# EAGLE design Invictus R2 Bot (EAGLE 9.6.2)
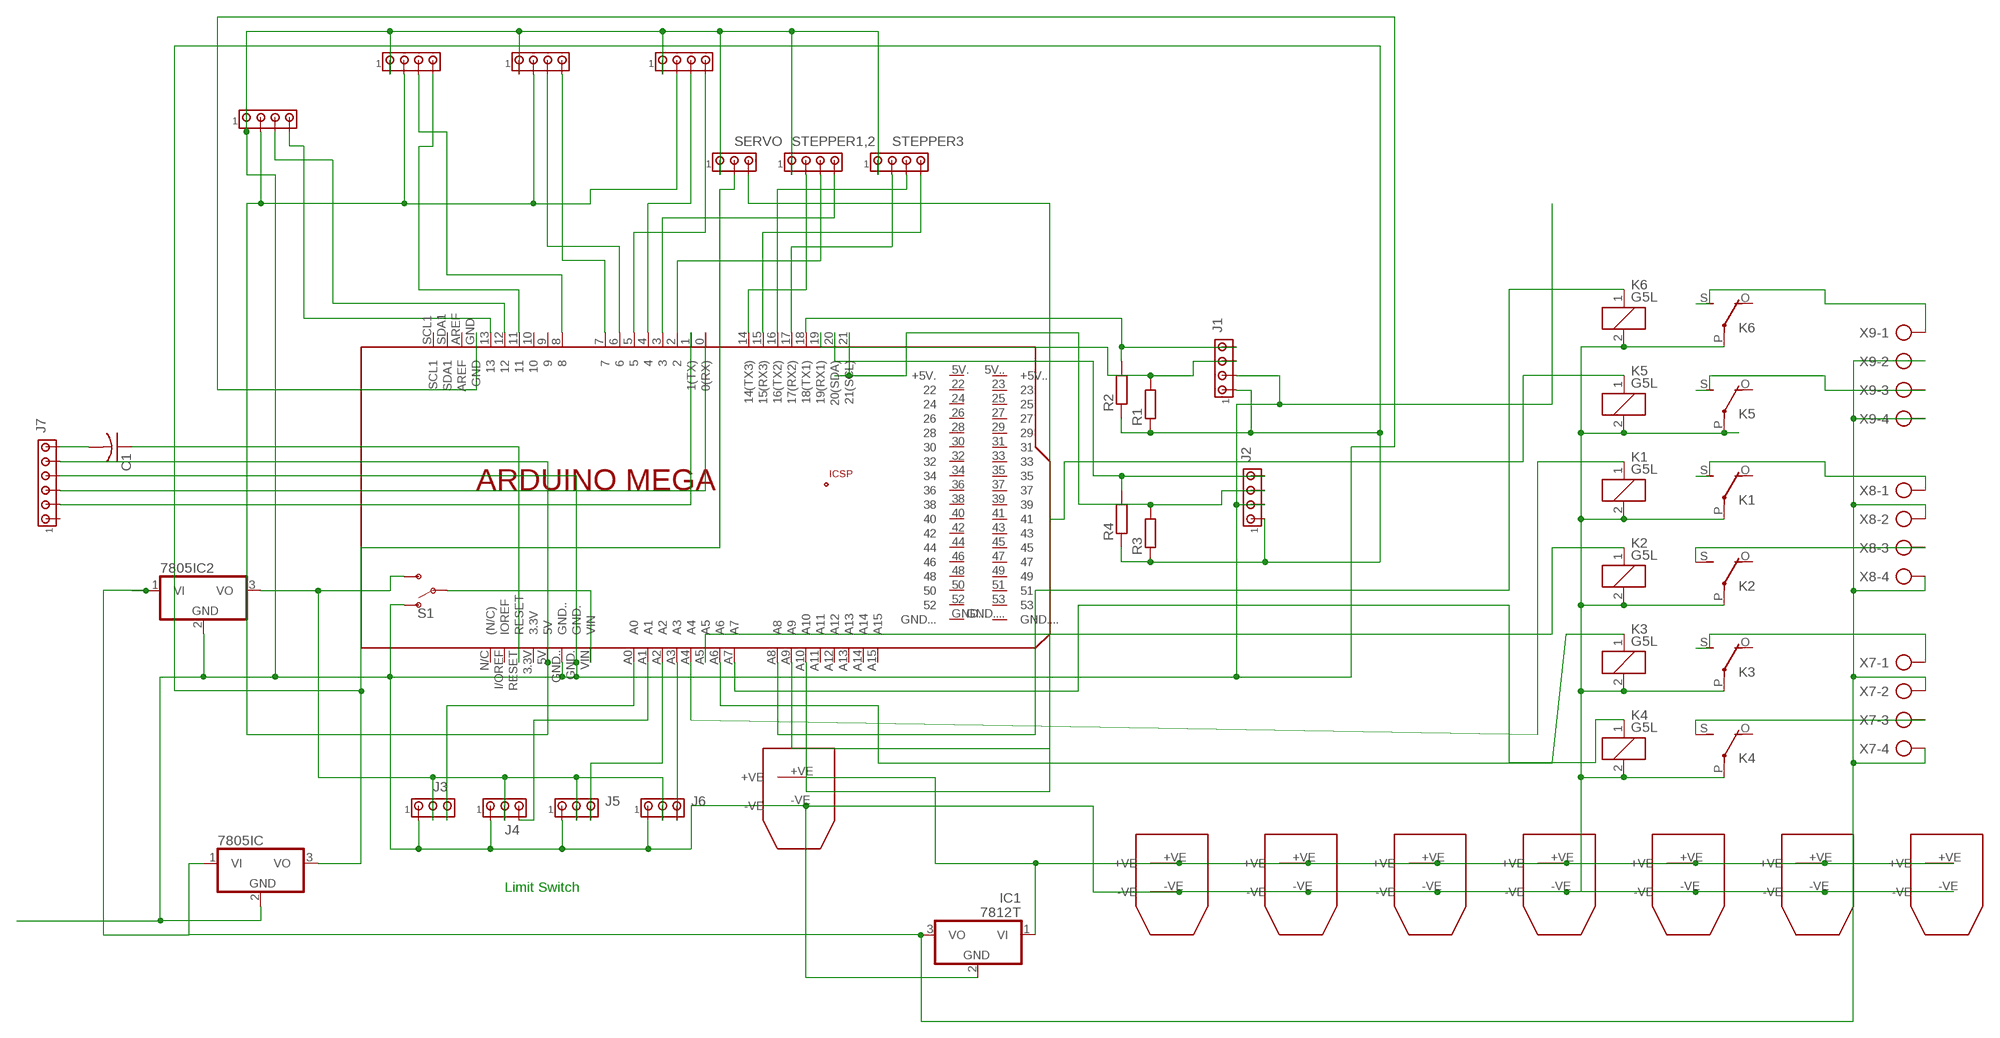
[diagram p0: schematic, sheet 1]

## Parts
7805IC  7812T  [TO220H]
7805IC2  7805T  [TO220H]
C1  C-US025-030X050  [C025-030X050]
IC1  7812T  [TO220H]
J1  MTA04-100  [10X04MTA]
J2  MTA04-100  [10X04MTA]
J3  MTA03-100  [10X03MTA]
J4  MTA03-100  [10X03MTA]
J5  MTA03-100  [10X03MTA]
J6  MTA03-100  [10X03MTA]
J7  MTA06-100  [10X06MTA]
K1  G5L  [G5LE]
K2  G5L  [G5LE]
K3  G5L  [G5LE]
K4  G5L  [G5LE]
K5  G5L  [G5LE]
K6  G5L  [G5LE]
PCB2  ARDUINO_MEGA2560  [ARDUINO_MEGA2560]
R1  R-EU_0207/7  [0207/7]
R2  R-EU_0207/7  [0207/7]
R3  R-EU_0207/7  [0207/7]
R4  R-EU_0207/7  [0207/7]
S1  SWITCH-SPDT-PTH-11.6X4.0MM  [SWITCH_SPDT_PTH_11.6X4.0MM]
SERVO  MTA03-100  [10X03MTA]
STEPPER1,1  MTA04-100  [10X04MTA]
STEPPER1,2  MTA04-100  [10X04MTA]
STEPPER1,3  MTA04-100  [10X04MTA]
STEPPER1,4  MTA04-100  [10X04MTA]
STEPPER1,5  MTA04-100  [10X04MTA]
STEPPER3  MTA04-100  [10X04MTA]
X7  AK500/4-H  [AK500/4-H]
X8  AK500/4-H  [AK500/4-H]
X9  AK500/4-H  [AK500/4-H]
XT1  XT60XT60  [XT60]
XT2  XT60XT60  [XT60]
XT3  XT60XT60  [XT60]
XT4  XT60XT60  [XT60]
XT5  XT60XT60  [XT60]
XT6  XT60XT60  [XT60]
XT7  XT60XT60  [XT60]
XT60  XT60XT60  [XT60]

## Nets
5V: 7805IC.3(VO) J1.1 J2.1 R1.1 R2.1 R3.1 R4.1 SERVO.2
12V: 7805IC2.1(VI) 7805IC.1(VI) IC1.3(VO) X7.2 X7.4 X8.2 X8.4 X9.2 X9.4
GND: 7805IC2.2(GND) 7805IC.2(GND) IC1.2(GND) J1.2 J2.2 J3.1 J4.1 J5.1 J6.1 J7.4 K1.2 K1.P(2:P) K2.2 K2.P(2:P) K3.2 K3.P(2:P) K4.2 K4.P(2:P) K5.2 K5.P(2:P) K6.2 K6.P(2:P) PCB2.GND PCB2.GND. PCB2.GND.. S1.1(O) SERVO.1 STEPPER1,1.1 STEPPER1,2.1 STEPPER1,3.1 STEPPER1,4.1 STEPPER1,5.1 STEPPER3.1 XT1.-VE XT2.-VE XT3.-VE XT4.-VE XT5.-VE XT6.-VE XT7.-VE XT60.-VE
N$1: PCB2.VIN S1.2(P)
N$2: K4.1 PCB2.A7
N$3: PCB2.5 STEPPER1,5.4
N$4: K3.1 PCB2.A6
N$5: PCB2.3 STEPPER1,2.4
N$6: J2.4 PCB2.20(20(SDA)) R4.2
N$7: J2.3 PCB2.21(21(SCL)) R3.2
N$8: J1.3 PCB2.19(19(RX1)) R1.2
N$9: PCB2.4 STEPPER1,5.3
N$10: PCB2.6 STEPPER1,4.3
N$11: PCB2.13 STEPPER1,1.4
N$12: PCB2.12 STEPPER1,1.3
N$13: PCB2.11 STEPPER1,3.4
N$14: PCB2.8 STEPPER1,3.3
N$15: PCB2.7 STEPPER1,4.4
N$16: PCB2.17(17(RX2)) STEPPER3.2
N$17: J1.4 PCB2.18(18(TX1)) R2.2
N$18: K2.1 PCB2.A5
N$19: PCB2.16(16(TX2)) STEPPER3.3
N$20: K1.1 PCB2.A4
N$21: J7.3 PCB2.0(0(RX))
N$22: K6.1 PCB2.A8
N$23: PCB2.A10 SERVO.3
N$24: J6.3 PCB2.A3
N$25: J7.2 PCB2.1(1(TX))
N$26: PCB2.2 STEPPER1,2.3
N$27: PCB2.14(14(TX3)) STEPPER1,2.2
N$28: PCB2.15(15(RX3)) STEPPER3.4
N$29: J3.3 PCB2.A0
N$30: J4.3 PCB2.A1
N$31: J5.3 PCB2.A2
N$32: K5.1 PCB2.A9
N$33: C1.1 PCB2.RESET
N$34: 7805IC2.3(VO) J3.2 J4.2 J5.2 J6.2 S1.3(S)
N$35: K6.S(2:S) X9.1
N$36: K5.S(2:S) X9.3
N$37: K1.S(2:S) X8.1
N$38: K2.S(2:S) X8.3
N$39: K3.S(2:S) X7.1
N$40: C1.2 J7.6
N$42: K4.S(2:S) X7.3
N$45: J7.5 PCB2.5V STEPPER1,1.2 STEPPER1,3.2 STEPPER1,4.2 STEPPER1,5.2
VCC: IC1.1(VI) XT1.+VE XT2.+VE XT3.+VE XT4.+VE XT5.+VE XT6.+VE XT7.+VE XT60.+VE
Unconnected: J7.1 K1.O(2:O) K2.O(2:O) K3.O(2:O) K4.O(2:O) K5.O(2:O) K6.O(2:O) PCB2.3.3V PCB2.5V.(+5V.) PCB2.5V..(+5V..) PCB2.9 PCB2.10 PCB2.22 PCB2.23 PCB2.24 PCB2.25 PCB2.26 PCB2.27 PCB2.28 PCB2.29 PCB2.30 PCB2.31 PCB2.32 PCB2.33 PCB2.34 PCB2.35 PCB2.36 PCB2.37 PCB2.38 PCB2.39 PCB2.40 PCB2.41 PCB2.42 PCB2.43 PCB2.44 PCB2.45 PCB2.46 PCB2.47 PCB2.48 PCB2.49 PCB2.50 PCB2.51 PCB2.52 PCB2.53 PCB2.+5V_ PCB2.A11 PCB2.A12 PCB2.A13 PCB2.A14 PCB2.A15 PCB2.AREF PCB2.GND... PCB2.GND.... PCB2.GND__ PCB2.I/OREF(IOREF) PCB2.MISO PCB2.MOSI PCB2.N/C((N/C)) PCB2.RESET. PCB2.SCK PCB2.SCL1 PCB2.SDA1

## Notes on the sheet
- Limit Switch

## Library data of the parts
7805IC 7805IC2 IC1 = linear:78*: Positive VOLTAGE REGULATOR Source: http://cache.national.com/ds/LM/LM78L05.pdf http://www.fairchildsemi.com/ds/LM/LM7805.pdf
C1 = resistor:C-US: CAPACITOR, American symbol
J1 J2 STEPPER1,1-STEPPER1,5 STEPPER3 = con-amp:MTA04-100: AMP connector
J3-J6 SERVO = con-amp:MTA03-100: AMP connector
J7 = con-amp:MTA06-100: AMP connector Connection corrected 2014-09-19
K1-K6 = relay:G5L: RELAY 1 x switch, 10 A/120 V AC, 8 A/30 V ADC, Omron; OC_FARNELL: unknown; OC_NEWARK: unknown
PCB2 = E14_Arduino_revC:ARDUINO_MEGA2560: Device for representing an Arduino Mega 2560 board with a footprint in an EAGLE design. Created by Dave Young for Element14. More EAGLE documentation at: http://www.element14.com/community/community/knode/cadsoft_eagle
R1-R4 = rcl:R-EU_: RESISTOR, European symbol; SPICEPREFIX: R
S1 = SparkFun-Switches:SWITCH-SPDT: Single Pole, Double Throw (SPDT) Switch Single-pole, double-throw (SPDT) switch. Variant Overview SMD-AYZ0202 Surface Mount DPDT Switch <https://www.sparkfun.com/products/597> (COM-00597) Used on e.g. LilyPad Arduino USB - ATmega32U4 Board <https://www.sparkfun.com/products/12049> PTH-11.6X4.0MM SPDT Mini Power Switch <https://www.sparkfun.com/products/102> (COM-00102) Used on e.g. SparkFun Simon Says - Through-Hole Soldering Kit <https://www.sparkfun.com/products/10547> (KIT-10547) PTH-11.6X4.0MM-KIT KIT version of SPDT Mini Power Switch - Simplifies soldering by removing tStop of switch pins - only one side can be soldered. PTH-11.6X4.0MM-LOCK LOCK version of SPDT Mini Power Switch - Offset pins hold switch in place for easier soldering. SMD-RIGHT-ANGLE Surface Mount Right Angle Switch <https://www.sparkfun.com/products/10860> (COM-10860) Used on e.g. SparkFun ESP8266 Thing <https://www.sparkfun.com/products/13231>; PROD_ID: SWCH-08261; SF_SKU: COM-00102
X7-X9 = con-ptr500:AK500/4-H: CONNECTOR Aug. 2004 / PTR Meßtechnik: Die Bezeichnung der Serie AK505 wurde geändert. Es handelt sich hierbei um AK500 in horizontaler Ausführung.; OC_FARNELL: unknown; OC_NEWARK: unknown
XT1-XT7 XT60 = xt60:XT60: XT60 connector

## Board
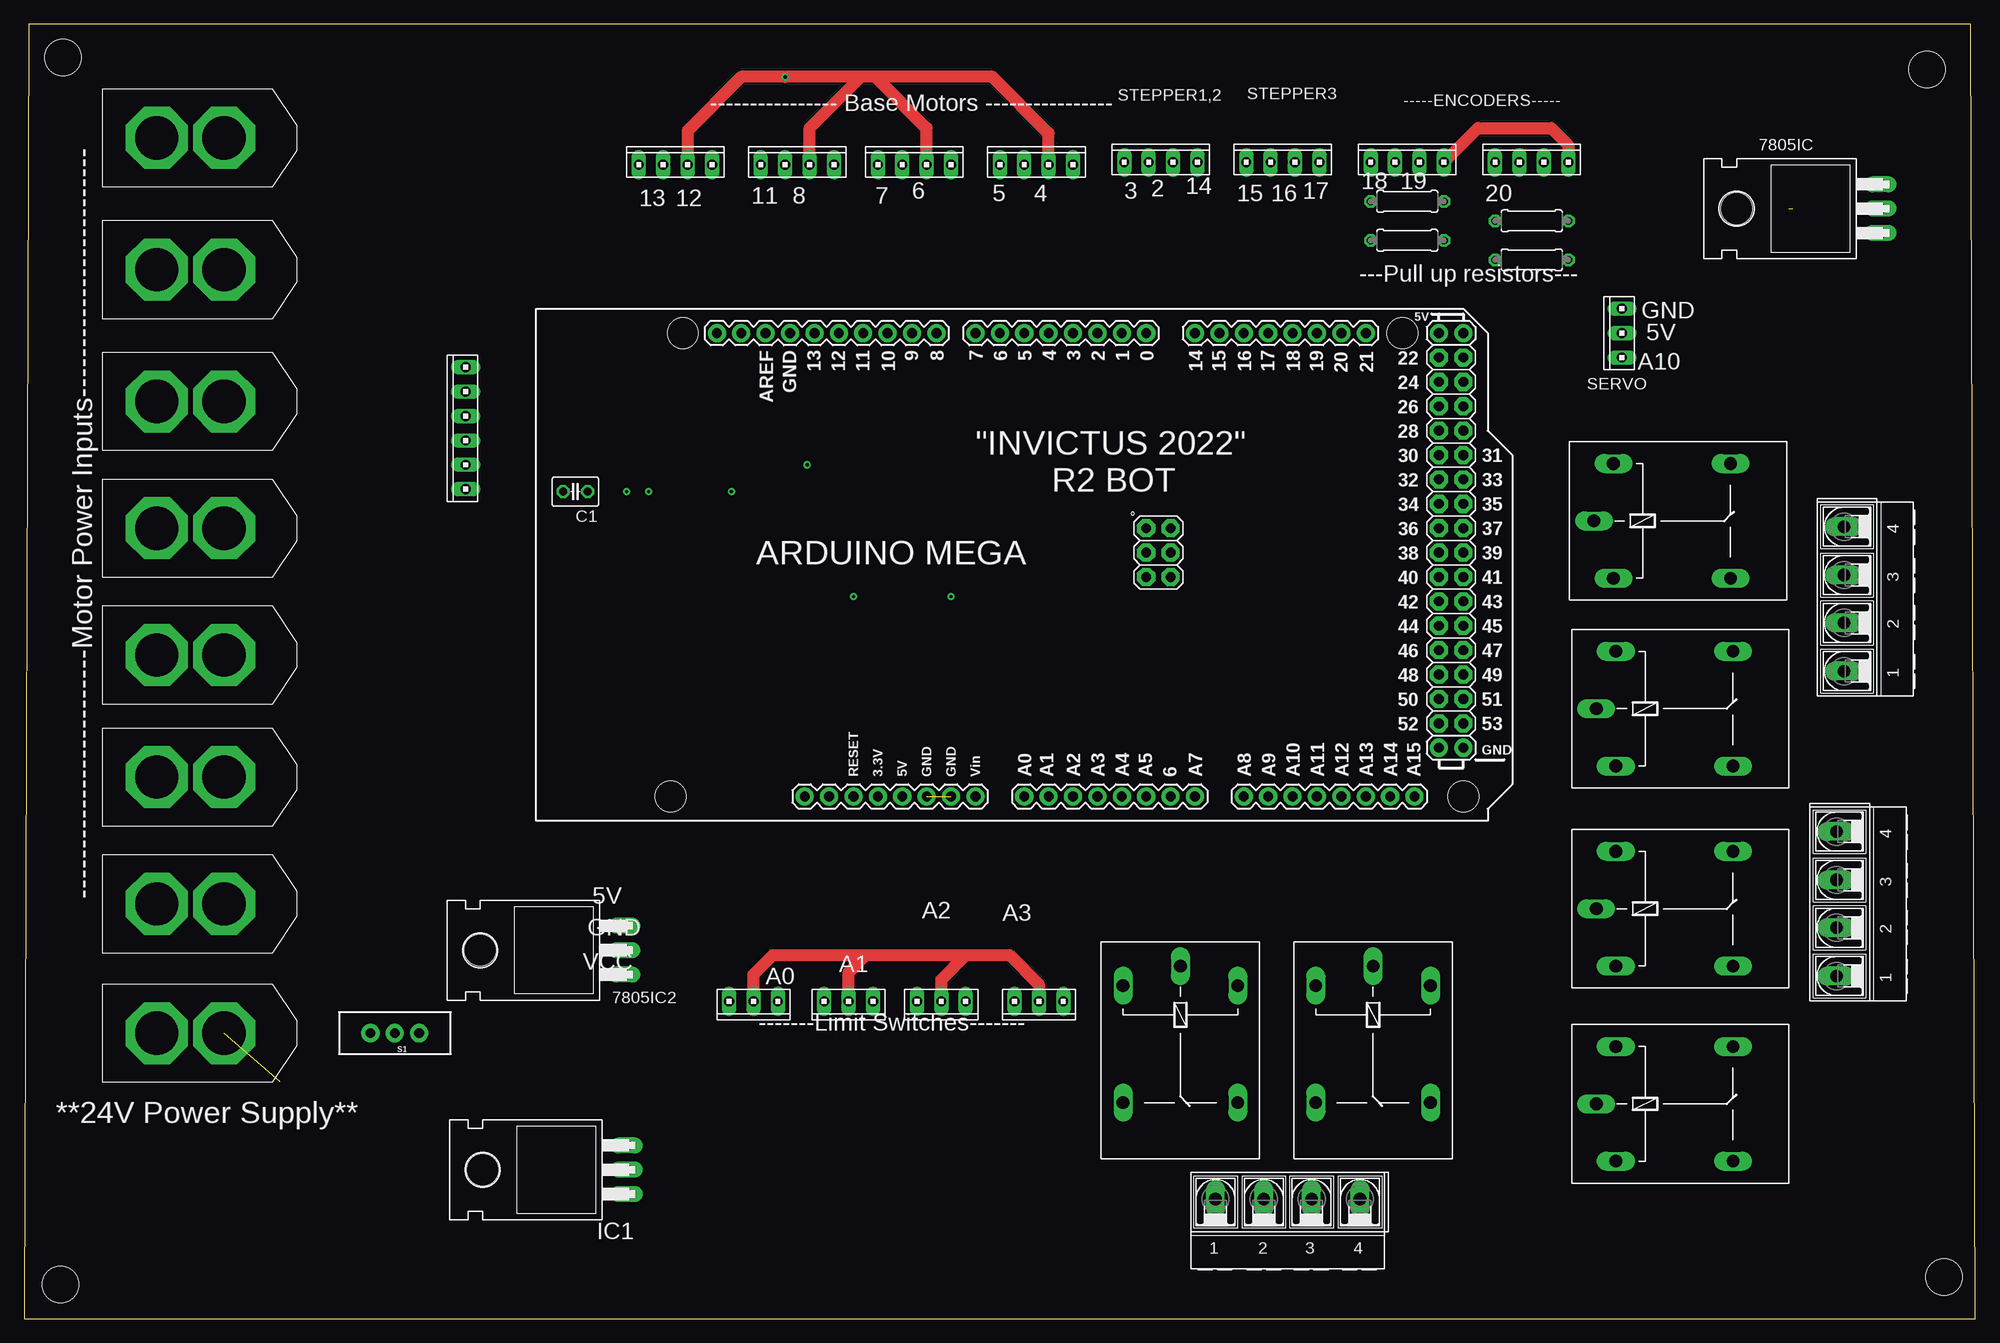
[diagram p1: board, top side]
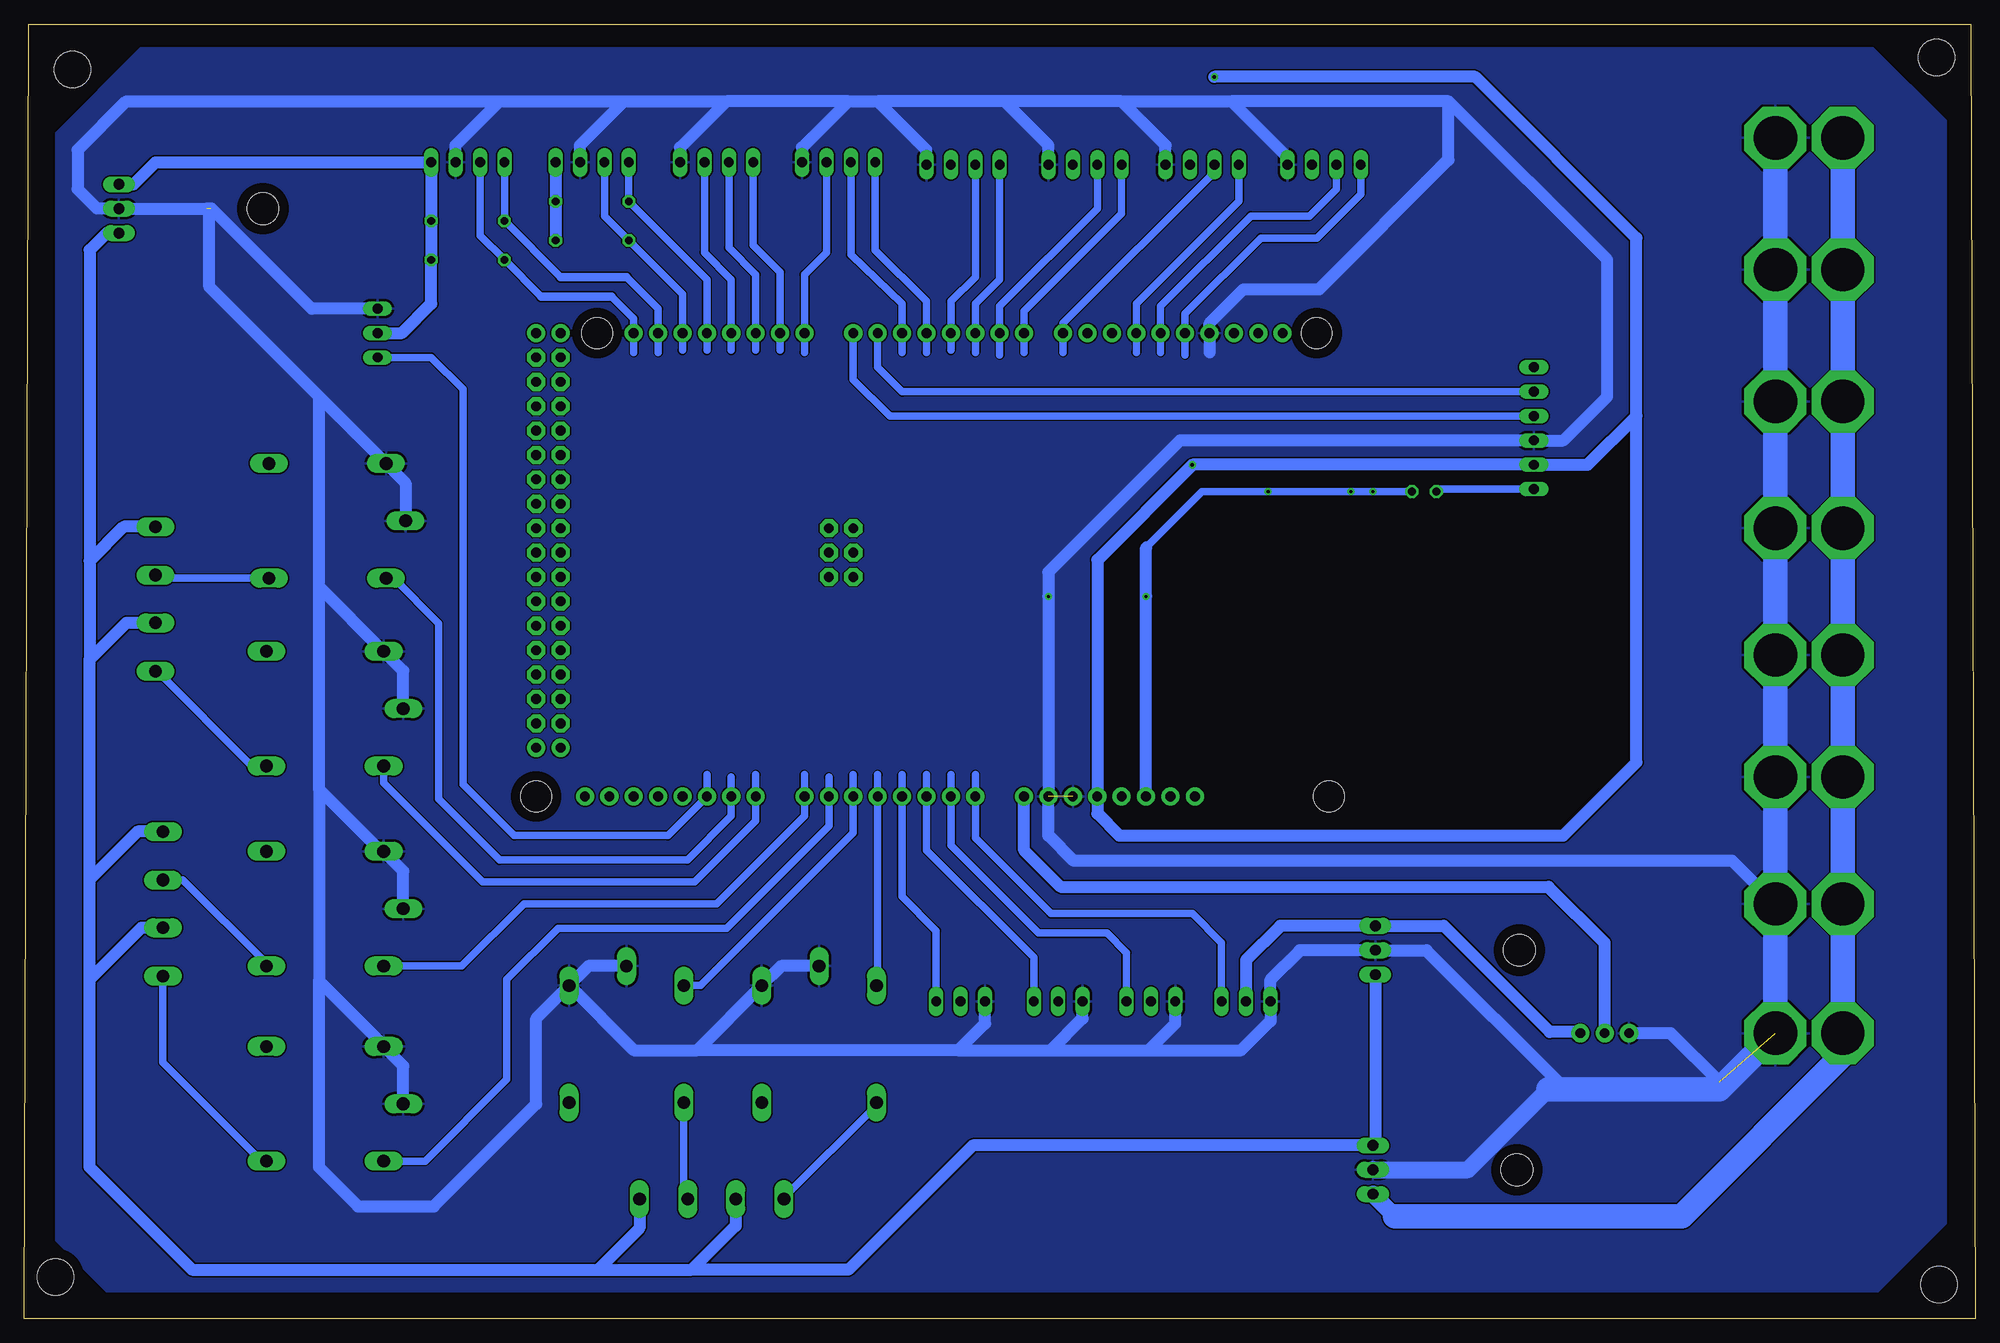
[diagram p2: board, bottom side, seen from below]

Size 203.18 x 134.8 mm. Coordinates in mm from the lower left corner, seen from the top.
Outline: 0,0 203.18,0 202.67,134.8 0.51,134.8 0,0
Copper layers (1*16): Top 0.035mm / dielectric 1.5mm / Bottom 0.035mm
Design rules "default": minimum track width 6mil, minimum drill 0.35mm, track to track 6mil, track to pad 6mil, pad to pad 6mil, via to via 6mil, smd to smd 6mil, copper to edge 40mil, drill to drill 6mil, minimum pad ring 10mil, minimum via ring 8mil, stop-mask expansion 4mil, vias tented up to drill 0mil, thermal gap 10mil
Holes 3.81 mm at 3.81,3.56 199.9,4.32 198.12,130.05 4.06,131.32

### Footprints (pad centres in the part's own frame; a part is rotated, then mirrored left to right if it is on the bottom)
TO220H = drill 1.118 long: 1 -2.54,-10.16; 2 0,-10.16; 3 2.54,-10.16 | hole 3.302: 0,4.826
C025-030X050 = drill 0.813 octagon: 1 -1.27,0; 2 1.27,0
10X04MTA = drill 1.016 long: 1 3.81,0; 2 1.27,0; 3 -1.27,0; 4 -3.81,0
10X03MTA = drill 1.016 long: 1 2.54,0; 2 0,0; 3 -2.54,0
10X06MTA = drill 1.016 long: 1 6.35,0; 2 3.81,0; 3 1.27,0; 4 -1.27,0; 5 -3.81,0; 6 -6.35,0
G5LE = drill 1.321 long: 1 -7.493,-5.969; 2 -7.493,5.969; O 4.699,5.969; P -9.525,0; S 4.699,-5.969
ARDUINO_MEGA2560 = drill 1.016 pad 1.88: 0 63.5,50.8; 1 60.96,50.8; 2 58.42,50.8; 3 55.88,50.8; 3.3V 35.56,2.54; 4 53.34,50.8; 5 50.8,50.8; 5V 38.1,2.54; 5V. 93.98,50.8; 5V.. 96.52,50.8; 6 48.26,50.8; 7 45.72,50.8; 8 41.656,50.8; 9 39.116,50.8; 10 36.576,50.8; 11 34.036,50.8; 12 31.496,50.8; 13 28.956,50.8; 14 68.58,50.8; 15 71.12,50.8; 16 73.66,50.8; 17 76.2,50.8; 18 78.74,50.8; 19 81.28,50.8; 20 83.82,50.8; 21 86.36,50.8; A0 50.8,2.54; A1 53.34,2.54; A2 55.88,2.54; A3 58.42,2.54; A4 60.96,2.54; A5 63.5,2.54; A6 66.04,2.54; A7 68.58,2.54; A8 73.66,2.54; A9 76.2,2.54; A10 78.74,2.54; A11 81.28,2.54; A12 83.82,2.54; A13 86.36,2.54; A14 88.9,2.54; A15 91.44,2.54; AREF 23.876,50.8; GND 26.416,50.8; GND. 43.18,2.54; GND.. 40.64,2.54; GND... 93.98,7.62; GND.... 96.52,7.62; I/OREF 30.48,2.54; N/C 27.94,2.54; RESET 33.02,2.54; SCL1 18.796,50.8; SDA1 21.336,50.8; VIN 45.72,2.54 | drill 1.016 pad 1.88 octagon: 22 93.98,48.26; 23 96.52,48.26; 24 93.98,45.72; 25 96.52,45.72; 26 93.98,43.18; 27 96.52,43.18; 28 93.98,40.64; 29 96.52,40.64; 30 93.98,38.1; 31 96.52,38.1; 32 93.98,35.56; 33 96.52,35.56; 34 93.98,33.02; 35 96.52,33.02; 36 93.98,30.48; 37 96.52,30.48; 38 93.98,27.94; 39 96.52,27.94; 40 93.98,25.4; 41 96.52,25.4; 42 93.98,22.86; 43 96.52,22.86; 44 93.98,20.32; 45 96.52,20.32; 46 93.98,17.78; 47 96.52,17.78; 48 93.98,15.24; 49 96.52,15.24; 50 93.98,12.7; 51 96.52,12.7; 52 93.98,10.16; 53 96.52,10.16; +5V_ 66.04,30.48; GND__ 66.04,25.4; MISO 63.5,30.48; MOSI 66.04,27.94; RESET. 63.5,25.4; SCK 63.5,27.94 | hole 3.2: 15.24,50.8; 13.97,2.54; 90.17,50.8; 96.52,2.54
0207/7 = drill 0.813 octagon: 1 -3.81,0; 2 3.81,0
SWITCH_SPDT_PTH_11.6X4.0MM = drill 1.016 pad 1.88: 1 0,2.54; 2 0,0; 3 0,-2.54
AK500/4-H = drill 1.321 long: 1 -7.518,0; 2 -2.489,0; 3 2.489,0; 4 7.518,0
XT60 = drill 4.5 pad 6.452 octagon: +VE 0,-7; -VE 0,0

### Placement (x,y rotation side)
7805IC  183.13,115.57 90 top
7805IC2  52.32,38.35 90 top
C1  57.4,86.11 180 top
IC1  52.58,15.49 90 top
J1  144.02,120.4 0 top
J2  156.97,120.4 0 top
J3  75.95,33.02 180 top
J4  85.85,33.02 180 top
J5  95.5,33.02 180 top
J6  105.66,33.02 180 top
J7  45.97,92.71 90 top
K1  120.4,27.18 270 top
K2  140.46,27.18 270 top
K3  173.23,22.35 0 top
K4  173.23,42.67 0 top
K5  172.97,83.06 0 top
K6  173.23,63.5 0 top
PCB2  53.34,51.82 0 top
R1  144.02,112.27 180 top
R2  144.02,116.33 180 top
R3  156.97,110.24 180 top
R4  156.97,114.3 180 top
S1  38.61,29.72 90 top
SERVO  166.37,102.62 90 top
STEPPER1,1  67.82,120.14 0 top
STEPPER1,2  118.36,120.4 0 top
STEPPER1,3  80.52,120.14 0 top
STEPPER1,4  92.71,120.14 0 top
STEPPER1,5  105.41,120.14 0 top
STEPPER3  131.06,120.4 0 top
X7  188.72,43.18 90 top
X8  131.57,12.45 0 top
X9  189.48,74.93 90 top
XT1  20.83,43.18 270 top
XT2  20.83,56.39 270 top
XT3  20.83,69.09 270 top
XT4  20.83,82.3 270 top
XT5  20.83,95.5 270 top
XT6  20.83,109.22 270 top
XT7  20.83,122.94 270 top
XT60  20.83,29.72 270 top

### Tracks (layer width: path | path; a pad name or v marks a point on that pad's centre or on a via)
5V
  Top 1.27: J1.1 151.38,123.95 159,123.95 160.78,122.17 J2.1
  Bottom 1.27: J1.1 R2.1 R1.1 | 7805IC.3 191.77,118.11 189.48,120.4 J2.1 R4.1 R3.1 160.78,105.66 163.83,102.62 SERVO.2
12V
  Bottom 1.27: 196.34,35.31 190.96,40.69 X7.2 | 196.34,35.31 196.34,15.75 185.67,5.08 143.41,5.08 | 196.34,35.31 196.34,45.72 | 196.34,45.72 191.36,50.7 X7.4 | 196.34,45.72 196.34,68.63 | X9.2 192.53,72.44 196.34,68.63 | 196.34,78.89 192.79,82.45 X9.4 | 7805IC.1 194.56,113.03 196.34,111.25 196.34,78.89 | 7805IC2.1 62.48,18.29 IC1.3 104.39,18.03 117.35,5.08 133.66,5.08 | 133.66,5.08 129.08,9.65 X8.2 | 143.41,5.08 133.66,5.08 | 196.34,78.89 196.34,68.63 | X8.4 139.09,9.4 143.41,5.08
GND  (via drill 0.35)  (3 unrouted)
  Bottom 1.27: 79.76,100.58 PCB2.GND 79.76,103.63 76.2,107.19 68.33,107.19 54.86,120.65 54.86,126.75 | 96.27,27.94 86.11,27.94 | 183.9,115.57 7805IC.2 195.58,115.57 197.61,117.6 197.61,121.67 192.53,126.75 153.67,126.75 | 183.9,115.57 183.77,115.57 | 184.15,115.57 183.64,115.57 173.23,105.16 SERVO.1 | 7805IC2.2 64.77,38.35 | 54.86,126.75 77.47,126.75 | 153.67,126.75 140.72,126.75 | 77.47,126.75 71.63,120.9 STEPPER1,1.1 | STEPPER1,3.1 84.33,122.17 88.9,126.75 | 101.09,126.75 96.52,122.17 STEPPER1,4.1 | STEPPER1,5.1 109.22,121.67 114.3,126.75 | 117.35,126.75 122.17,121.92 STEPPER1,2.1 | 117.35,126.75 130.05,126.75 | STEPPER3.1 134.87,121.92 130.05,126.75 | J1.2 145.29,122.17 140.72,126.75 | J2.2 158.24,122.17 153.67,126.75 | 88.9,126.75 101.09,126.75 | 101.09,126.75 114.3,126.75 | K1.P 124.33,36.7 K1.2 133.1,27.94 | K2.P 144.4,36.7 K2.2 | K4.P 163.7,46.61 K4.2 165.99,48.64 172.47,55.12 | K3.2 164.72,28.32 | K3.P 163.7,26.29 K3.2 | 172.47,35.18 165.74,28.45 K3.2 | 172.47,55.12 172.47,35.18 | 165.61,28.45 K3.2 | K2.2 149.86,31.24 149.86,22.35 160.53,11.68 168.4,11.68 172.47,15.75 172.47,35.18 | 172.47,55.12 172.47,76.2 | 172.47,76.2 172.47,96.01 | 165.74,89.03 K5.2 | K5.2 163.45,87 K5.P | K6.P 163.7,67.44 K6.2 172.47,76.2 | K5.2 172.47,96.01 | 172.47,96.01 183.9,107.44 183.9,115.57 | 7805IC2.2 70.36,38.35 73.41,35.31 J3.1 73.41,30.99 76.45,27.94 86.11,27.94 | 86.11,27.94 83.31,30.73 J4.1 | 96.27,27.94 92.96,31.24 J5.1 | 105.92,27.94 103.12,30.73 J6.1 | 105.92,27.94 96.27,27.94 | 105.92,27.94 133.1,27.94 | K2.2 139.7,27.94 133.1,27.94 | 88.9,126.75 77.47,126.75 | XT1.-VE 25.32,47.68 93.9,47.68 96.52,50.29 PCB2.GND. v96.52,75.18 96.52,77.72 82.8,91.44 J7.4 42.93,91.44 38.35,96.01 38.35,110.24 54.86,126.75
  Bottom 1.27: 140.72,126.75 130.05,126.75 | 117.35,126.75 114.3,126.75 | 26.67,24.64 31.75,29.72 S1.1 | 43.69,24.38 43.18,24.38 57.15,38.35 7805IC2.2
  Bottom 1.778: IC1.2 52.83,15.49 44.45,23.88
  Bottom 2.54: XT7.-VE XT6.-VE XT5.-VE XT4.-VE XT3.-VE XT2.-VE XT1.-VE XT60.-VE 26.67,23.88 44.45,23.88
  pour Bottom: 3.05,124.71 3.05,9.91 10.16,2.79 194.56,2.79 199.9,8.13 199.9,123.44 191.01,132.33 10.67,132.33
N$1
  Bottom 1.27: PCB2.VIN 99.06,48.77 95.25,44.96 44.45,44.96 38.61,39.12 S1.2
N$2
  Bottom 0.762: 121.92,56.64 PCB2.A7 121.92,52.32 131.06,43.18 151.13,43.18 157.61,36.7 K4.1
N$3
  Bottom 0.762: STEPPER1,5.4 101.6,108.2 104.14,105.66 PCB2.5 104.14,100.58
N$4
  Bottom 0.762: K3.1 161.42,16.38 152.91,24.89 152.91,35.31 147.57,40.64 130.05,40.64 119.38,51.31 PCB2.A6 119.38,56.39
N$5
  Bottom 0.762: STEPPER1,2.4 114.55,111.25 109.22,105.92 PCB2.3 109.22,100.58
N$6
  Bottom 0.762: 140.46,108.46 137.16,105.16 PCB2.20 137.16,100.58 | J2.4 R4.2 147.32,108.46
  Bottom 0.889: 140.46,108.46 147.32,108.46
N$7
  Bottom 0.762: 141.99,106.43 139.7,104.14 PCB2.21 139.7,100.58 | 149.35,106.43 R3.2 155.7,112.78 J2.3
  Bottom 0.889: 141.99,106.43 149.35,106.43
N$8
  Bottom 0.762: J1.3 142.75,114.81 R1.2 134.62,106.68 PCB2.19 134.62,100.84
N$9
  Bottom 0.762: STEPPER1,5.3 104.14,108.46 106.68,105.92 PCB2.4 106.68,100.84
N$10
  Bottom 0.762: STEPPER1,4.3 91.44,115.57 101.6,105.41 PCB2.6 101.6,100.33
N$11
  Bottom 0.762: STEPPER1,1.4 64.01,117.09 68.58,112.52 74.42,112.52 82.3,104.65 PCB2.13 82.3,100.33
N$12
  Bottom 0.762: STEPPER1,1.3 66.55,117.6 69.34,114.81 75.44,114.81 84.84,105.41 PCB2.12 84.84,100.58
N$13
  Bottom 0.762: STEPPER1,3.4 76.71,116.33 87.38,105.66 PCB2.11 87.38,100.58
N$14
  Bottom 0.762: STEPPER1,3.3 79.25,119.38 95,103.63 PCB2.8 95,100.58
N$15
  Bottom 0.762: STEPPER1,4.4 88.9,115.06 99.06,104.9 PCB2.7 99.06,100.58
N$16
  Bottom 0.762: STEPPER3.2 132.33,111 129.54,108.2 PCB2.17 129.54,100.84
N$17
  Bottom 0.762: J1.4 R2.2 132.08,108.2 PCB2.18 132.08,100.84
N$18
  Bottom 0.762: K2.1 132.72,34.67 116.84,50.55 PCB2.A5 116.84,56.64
N$19
  Bottom 0.762: STEPPER3.3 129.79,111.51 127,108.71 PCB2.16 127,100.84
N$20
  Bottom 0.762: K1.1 114.3,34.8 PCB2.A4 114.3,56.64
N$21
  Bottom 0.762: PCB2.0 116.84,97.79 113.03,93.98 J7.3
N$22
  Bottom 0.762: 127,56.64 PCB2.A8 127,51.82 133.35,45.47 155.45,45.47 165.74,55.75 K6.1
N$23
  Bottom 0.762: 132.08,56.64 PCB2.A10 136.14,50.29 152.15,50.29 157.48,55.63 157.48,96.77 160.78,100.08 SERVO.3
N$24
  Bottom 0.762: J6.3 108.2,40.39 111.76,43.94 PCB2.A3 111.76,56.64
N$25
  Bottom 0.762: PCB2.1 114.3,99.06 111.76,96.52 J7.2
N$26
  Bottom 0.762: STEPPER1,2.3 117.09,110.78 111.76,105.66 PCB2.2 111.76,100.58
N$27
  Bottom 0.762: STEPPER1,2.2 119.63,111 121.92,108.71 PCB2.14 121.92,100.58
N$28
  Bottom 0.762: STEPPER3.4 127.25,111.76 124.46,108.97 PCB2.15 124.46,100.84
N$29
  Bottom 0.762: J3.3 78.49,39.12 81.53,42.16 96.27,42.16 104.14,50.04 PCB2.A0 104.14,56.64
N$30
  Bottom 0.762: J4.3 88.39,38.1 90.42,40.13 97.54,40.13 106.68,49.28 PCB2.A1 106.68,56.64
N$31
  Bottom 0.762: J5.3 98.04,37.59 109.22,48.77 PCB2.A2 109.22,56.64
N$32
  Bottom 0.762: 129.54,56.39 PCB2.A9 129.54,52.32 134.11,47.75 153.67,47.75 160.02,54.1 160.02,72.39 164.72,77.09 K5.1
N$33  (via drill 0.35)
  Bottom 0.762: 86.36,80.52 86.36,80.26 80.52,86.11 v73.66,86.11 v65.02,86.11 v62.74,86.11 C1.1
  Bottom 1.27: PCB2.RESET v86.36,75.18 86.36,80.26
N$34
  Top 1.27: J3.2 75.95,35.81 77.98,37.85 87.63,37.85 85.85,36.07 J4.2 | 86.11,37.85 98.04,37.85 95.5,35.31 J5.2 | 95.76,37.85 102.58,37.85 105.66,34.77 J6.2
  Bottom 1.27: 41.25,29.72 S1.3 41.15,29.84 44.32,29.84 55.37,40.89 7805IC2.3 72.39,40.89 75.95,37.34 J3.2
N$35
  Bottom 0.762: X9.1 189.33,67.41 179.45,57.53 K6.S
N$36
  Bottom 0.508: X9.3 189.15,77.09
  Bottom 0.762: 189.15,77.09 K5.S
N$37
  Bottom 0.762: X8.1 124.05,12.6 114.43,22.23 K1.S
N$38
  Bottom 0.762: K2.S 134.49,12.88 X8.3
N$39
  Bottom 0.762: X7.1 188.72,26.67 178.44,16.38 K3.S
N$40
  Bottom 0.762: J7.6 55.88,86.36 C1.2
N$42
  Bottom 0.508: X7.3 186.64,45.67
  Bottom 0.762: 186.64,45.67 177.93,36.96 K4.S
N$45  (via drill 0.35)
  Top 1.27: STEPPER1,5.2 106.68,123.44 100.84,129.29 88.65,129.29 | STEPPER1,1.2 69.09,123.7 74.68,129.29 v79.25,129.29 87.12,129.29 | 88.65,129.29 87.12,129.29 | STEPPER1,3.2 81.79,123.95 87.12,129.29 | 88.65,129.29 93.98,123.95 STEPPER1,4.2
  Bottom 1.27: v79.25,129.29 52.07,129.29 35.31,112.52 35.31,93.98 | 35.31,93.98 40.39,88.9 J7.5 v81.53,88.9 91.44,78.99 PCB2.5V 91.44,52.58 89.15,50.29 42.93,50.29 35.31,57.91 35.31,93.98
VCC
  Bottom 1.778: 60.45,10.67 61.59,11.81 IC1.1
  Bottom 2.54: XT7.+VE XT6.+VE XT5.+VE XT4.+VE XT3.+VE XT2.+VE XT1.+VE XT60.+VE 13.83,27.43 30.59,10.67 60.45,10.67

### Text on the board
tPlace: -----ENCODERS----- | ---------------- Base Motors ---------------- | 2 | 14 | 18 | 19 | 13 | 12 | 11 | 8 | 7 | 6 | 5 | 4 | 3 | 15 | 16 | 17 | 20 | ---Pull up resistors--- | GND | 5V | A10 | "INVICTUS 2022" / R2 BOT | -------------------------Motor Power Inputs------------------------- | 5V | A2 | A3 | GND | VCC | A0 | A1 | -------Limit Switches------- | **24V Power Supply**